# Altium schematic sheet conn_fan.SchDoc
size A
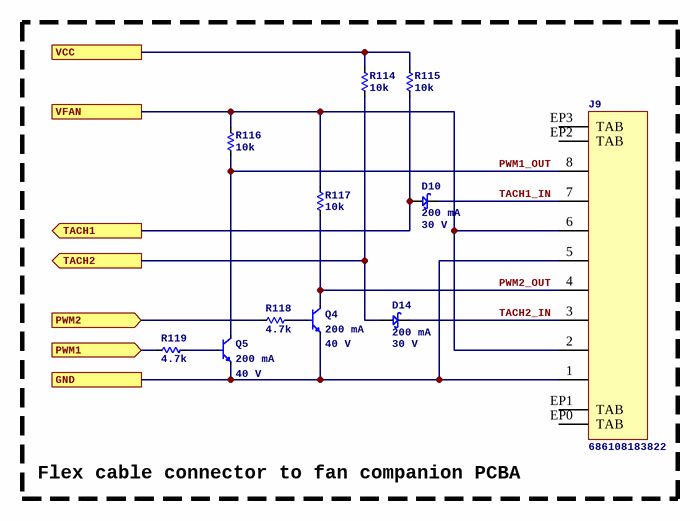
[diagram p0: conn_fan.SchDoc]

## Parts
D10  Current: 200 mA  Voltage: 30 V  [SOD523]  (hidden comment: BAT54XV2T1G)
D14  Current: 200 mA  Voltage: 30 V  [SOD523]  (hidden comment: BAT54XV2T1G)
J9  686108183822  [WURTH_WR-FPC_1.00mm_686108183822]
Q4  Current: 200 mA  Voltage: 40 V  [3SOT523]  (hidden comment: MMBT3904T)
Q5  Current: 200 mA  Voltage: 40 V  [3SOT523]  (hidden comment: MMBT3904T)
R114  value 10k  [R0402]  (hidden comment: 0402WGF1002TCE)
R115  value 10k  [R0402]  (hidden comment: 0402WGF1002TCE)
R116  value 10k  [R0402]  (hidden comment: 0402WGF1002TCE)
R117  value 10k  [R0402]  (hidden comment: 0402WGF1002TCE)
R118  value 4.7k  [R0402]  (hidden comment: 0402WGF4701TCE)
R119  value 4.7k  [R0402]  (hidden comment: 0402WGF4701TCE)

## Blocks framed on the sheet
Flex cable connector to fan companion PCBA: D10 D14 J9 Q4 Q5 R114-R119

## Ports
GND, PWM1 (in), PWM2 (in), TACH1 (out), TACH2 (out), VCC, VFAN

## Nets
GND: J9.1 J9.5 Q4.2(E) Q5.2(E) ; port GND
PWM1: R119.2 ; port PWM1
PWM1_OUT: J9.8 Q5.3(C) R116.2
PWM2: R118.2 ; port PWM2
PWM2_OUT: J9.4 Q4.3(C) R117.2
TACH1: D10.1 R115.2 ; port TACH1
TACH1_IN: D10.2 J9.7
TACH2: D14.1 R114.2 ; port TACH2
TACH2_IN: D14.2 J9.3
VCC: R114.1 R115.1 ; port VCC
VFAN: J9.2 J9.6 R116.1 R117.1 ; port VFAN
NetQ4_1: Q4.1(B) R118.1
NetQ5_1: Q5.1(B) R119.1

Not connected (* = marked no-connect by the designer): J9 EP0(TAB) EP1(TAB) EP2(TAB) EP3(TAB)

## Library data of the parts
D10 D14 = SCHOTTKY_30V_BAT54XV2T1G: ON Semi BAT54XV2T1G; SMT Schottky Diode; 30V 200mA; 5ns; 2-Pin SOD-523; Manufacturer: onsemi; Supplier 1: DigiKey; Supplier Part Number 1: BAT54XV2T1GOSCT-ND; Manufacturer Part Number: BAT54XV2T1G; Supplier 2: LCSC; Supplier Part Number 2: C81572; ComponentLink1Description: Datasheet; ComponentLink1URL: https://www.onsemi.com/pdf/datasheet/bat54xv2t1-d.pdf
J9 = CONN_WURTH_WR-FPC_8POS_1.00mm_686108183822: CONN FFC VERT 8POS 1MM SMD; Manufacturer: Wurth Elektronik; Supplier 1: Digikey; Supplier Part Number 1: 732-6018-1-ND; Manufacturer Part Number: 686108183822; Supplier 2: Mouser; Supplier Part Number 2: 710-686108183822; ComponentLink1Description: Drawing; ComponentLink1URL: https://www.we-online.com/components/products/datasheet/686104148922.pdf
Q4 Q5 = NPN_40V_MMBT3904T: Bipolar (BJT) Transistor NPN 40 V 200 mA 300MHz 150 mW Surface Mount SOT-523; Manufacturer: Shenzhen Slkormicro Semicon Co., Ltd.; Supplier 1: Digikey; Supplier Part Number 1: 5399-MMBT3904TCT-ND; Manufacturer Part Number: MMBT3904T; ComponentLink1Description: Datasheet; ComponentLink1URL: https://mm.digikey.com/Volume0/opasdata/d220001/medias/docus/7136/5399_MMBT3904T%20SOT-523.pdf; Supplier 2: LCSC; Supplier Part Number 2: C61616
R114-R117 = 0402WGF1002TCE: Manufacturer: UNI-ROYAL(Uniroyal Elec); Tolerance: 1%; Temperature Coefficient: Â±100ppm/â„ƒ; Power Rating (mW): 62.5; ComponentLink1Description: Datasheet; ComponentLink1URL: https://wmsc.lcsc.com/wmsc/upload/file/pdf/v2/lcsc/2206010100_UNI-ROYAL-Uniroyal-Elec-0402WGF1002TCE_C25744.pdf; Manufacturer Part Number: 0402WGF1002TCE; Package: 0402; Supplier 2: LCSC; Supplier Part Number 2: C25744
R118 R119 = 0402WGF4701TCE: Manufacturer: UNI-ROYAL(Uniroyal Elec); Tolerance: 1%; Temperature Coefficient: Â±100ppm/â„ƒ; Power Rating (mW): 62.5; ComponentLink1Description: Datasheet; ComponentLink1URL: https://wmsc.lcsc.com/wmsc/upload/file/pdf/v2/lcsc/2206010045_UNI-ROYAL-Uniroyal-Elec-0402WGF4701TCE_C25900.pdf; Manufacturer Part Number: 0402WGF4701TCE; Package: 0402; Supplier 2: LCSC; Supplier Part Number 2: C25900